# Altium schematic sheet Parent_sheet.SchDoc
size 594 x 420 mm; SheetNumber: 1; SheetTotal: 32; Scale: -; DocumentType: Схема электрическая принципиальная; DocumentGOSTLIt1: ㅤ; DocumentGOSTLIt2: ㅤ; DocumentGOSTLIt3: ㅤ; DocumentGOSTNote: Элементы, отмеченные *, используются при трассировке печатной платы, в состав модуля не включаются.; DocumentTypeShort: Э3; DocumentInvertoryNumber: ㅤ
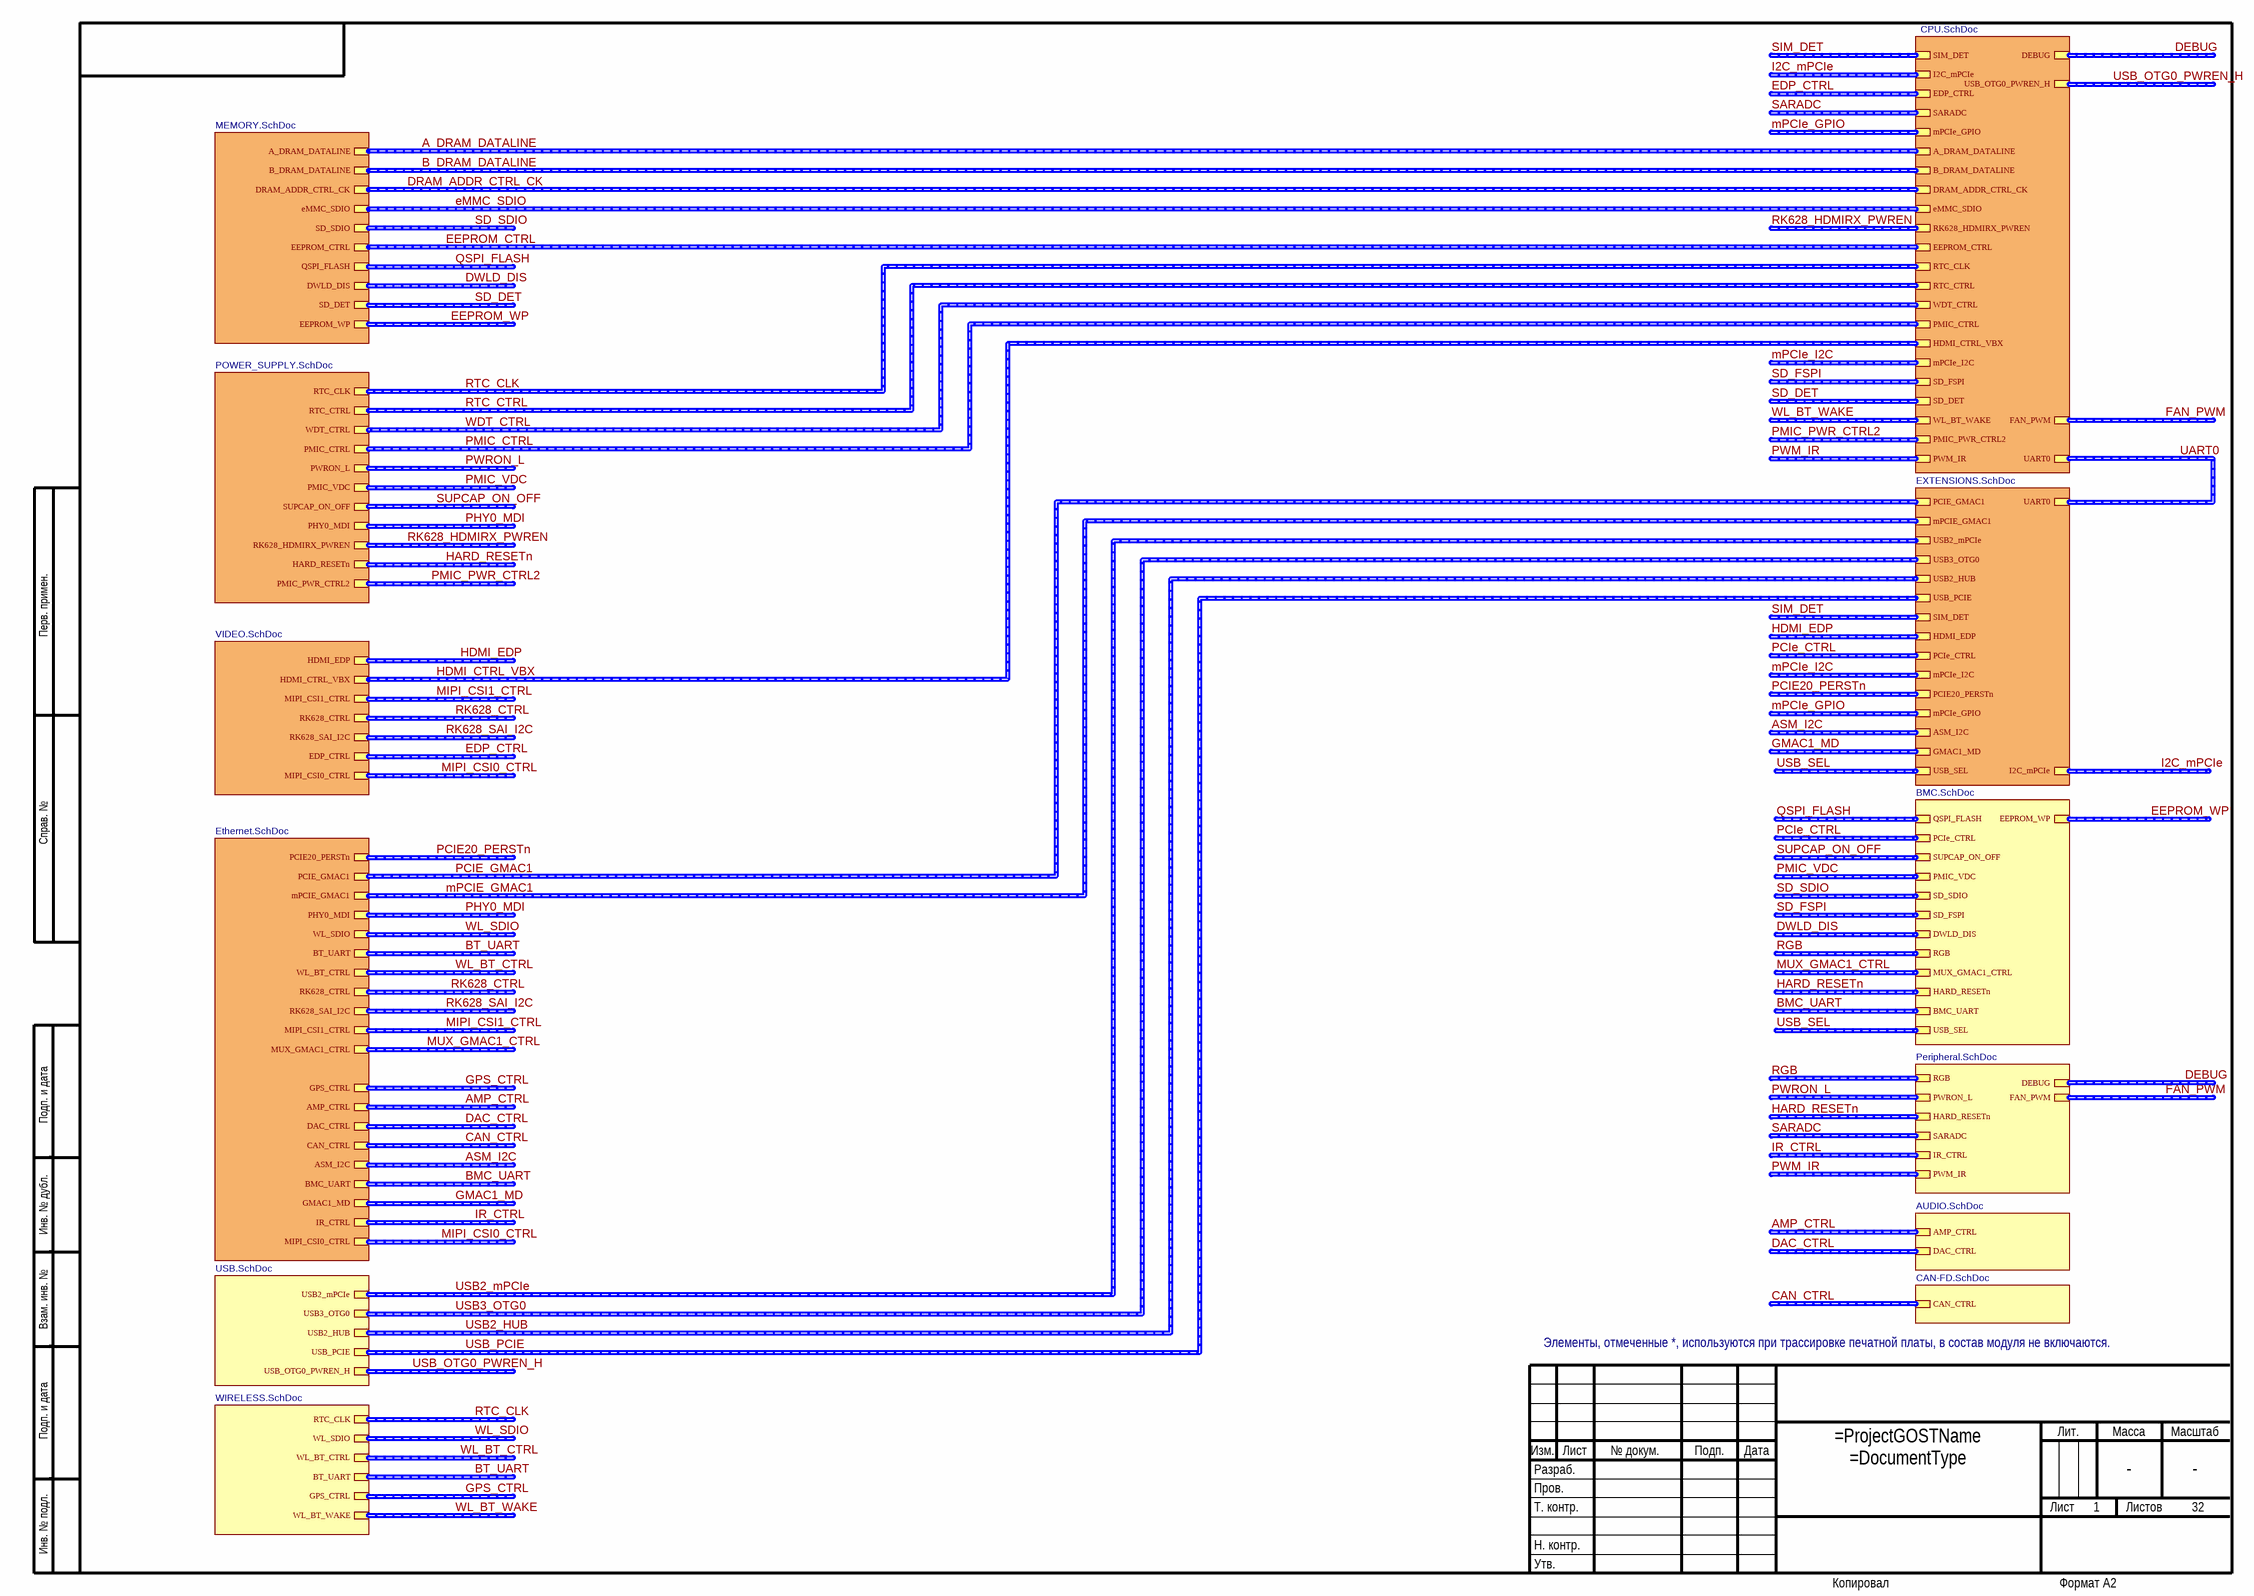
[diagram p0: Parent_sheet.SchDoc]

## Sub-sheets
AUDIO = AUDIO.SchDoc: AMP_CTRL (harness AMP_CTRL), DAC_CTRL (harness DAC_CTRL)
BMC = BMC.SchDoc: QSPI_FLASH (harness QSPI_FLASH), PCIe_CTRL (harness PCIe_CTRL), SUPCAP_ON_OFF (harness SUPCAP_ON_OFF), PMIC_VDC (harness PMIC_VDC), SD_SDIO (harness SD_SDIO), SD_FSPI (harness SD_FSPI), DWLD_DIS (harness DWLD_DIS), RGB (harness RGB), MUX_GMAC1_CTRL (harness MUX_GMAC1_CTRL), HARD_RESETn (harness HARD_RESETn), BMC_UART (harness BMC_UART), USB_SEL (harness USB_SEL), EEPROM_WP (harness EEPROM_WP)
CAN-FD = CAN-FD.SchDoc: CAN_CTRL (harness CAN_CTRL)
CPU = CPU.SchDoc: A_DRAM_DATALINE, B_DRAM_DATALINE, DRAM_ADDR_CTRL_CK, HDMI_CTRL_VBX, WDT_CTRL, RTC_CLK, RTC_CTRL, eMMC_SDIO, PMIC_CTRL, EEPROM_CTRL, SD_FSPI, SD_DET, WL_BT_WAKE, EDP_CTRL, SARADC, mPCIe_GPIO, RK628_HDMIRX_PWREN, SIM_DET, mPCIe_I2C, PMIC_PWR_CTRL2, PWM_IR, I2C_mPCIe, DEBUG, UART0, FAN_PWM, USB_OTG0_PWREN_H
Ethernet = Ethernet.SchDoc: PCIE_GMAC1, mPCIE_GMAC1, PHY0_MDI, WL_SDIO, BT_UART, WL_BT_CTRL, RK628_SAI_I2C, MIPI_CSI1_CTRL, MUX_GMAC1_CTRL, RK628_CTRL, GPS_CTRL, AMP_CTRL, DAC_CTRL, CAN_CTRL, ASM_I2C, BMC_UART, GMAC1_MD, PCIE20_PERSTn, IR_CTRL, MIPI_CSI0_CTRL
EXTENSIONS = EXTENSIONS.SchDoc: mPCIe_GPIO, SIM_DET, mPCIe_I2C, PCIE_GMAC1, mPCIE_GMAC1, USB3_OTG0, USB2_HUB, USB_PCIE, PCIe_CTRL, USB2_mPCIe, HDMI_EDP, ASM_I2C, GMAC1_MD, PCIE20_PERSTn, USB_SEL, I2C_mPCIe, UART0
MEMORY = MEMORY.SchDoc: A_DRAM_DATALINE, B_DRAM_DATALINE, DRAM_ADDR_CTRL_CK, eMMC_SDIO, SD_SDIO, EEPROM_CTRL, DWLD_DIS, SD_DET, QSPI_FLASH, EEPROM_WP
Peripheral = Peripheral.SchDoc: RGB (harness RGB), PWRON_L (harness PWRON_L), SARADC (harness SARADC), HARD_RESETn (harness HARD_RESETn), IR_CTRL (harness IR_CTRL), PWM_IR (harness PWM0_IR), DEBUG (harness DEBUG), FAN_PWM (harness FAN_PWM)
POWER_SUPPLY = POWER_SUPPLY.SchDoc: SUPCAP_ON_OFF, RTC_CLK, RTC_CTRL, WDT_CTRL, PHY0_MDI, PMIC_CTRL, PWRON_L, PMIC_VDC, HARD_RESETn, PMIC_PWR_CTRL2, RK628_HDMIRX_PWREN
USB = USB.SchDoc: USB2_mPCIe (harness USB2_mPCIe), USB3_OTG0 (harness USB3_OTG0), USB2_HUB (harness USB2_HUB), USB_PCIE (harness USB_PCIE), USB_OTG0_PWREN_H (harness USB_OTG0_PWREN_H)
VIDEO = VIDEO.SchDoc: HDMI_CTRL_VBX, MIPI_CSI1_CTRL, HDMI_EDP, RK628_SAI_I2C, EDP_CTRL, RK628_CTRL, MIPI_CSI0_CTRL
WIRELESS = WIRELESS.SchDoc: WL_SDIO (harness WL_SDIO), WL_BT_CTRL (harness WL_BT_CTRL), RTC_CLK (harness RTC_CLK), BT_UART (harness BT_UART), GPS_CTRL (harness GPS_CTRL), WL_BT_WAKE (harness WL_BT_WAKE)

## Buses and harness runs
harness A_DRAM_DATALINE = sheet CPU/A_DRAM_DATALINE = sheet MEMORY/A_DRAM_DATALINE
harness AMP_CTRL = sheet AUDIO/AMP_CTRL
harness AMP_CTRL = sheet Ethernet/AMP_CTRL
harness ASM_I2C = sheet Ethernet/ASM_I2C
harness ASM_I2C = sheet EXTENSIONS/ASM_I2C
harness B_DRAM_DATALINE = sheet CPU/B_DRAM_DATALINE = sheet MEMORY/B_DRAM_DATALINE
harness BMC_UART = sheet BMC/BMC_UART
harness BMC_UART = sheet Ethernet/BMC_UART
harness BT_UART = sheet Ethernet/BT_UART
harness BT_UART = sheet WIRELESS/BT_UART
harness CAN_CTRL = sheet CAN-FD/CAN_CTRL
harness CAN_CTRL = sheet Ethernet/CAN_CTRL
harness DAC_CTRL = sheet AUDIO/DAC_CTRL
harness DAC_CTRL = sheet Ethernet/DAC_CTRL
harness DEBUG = sheet CPU/DEBUG
harness DEBUG = sheet Peripheral/DEBUG
harness DRAM_ADDR_CTRL_CK = sheet CPU/DRAM_ADDR_CTRL_CK = sheet MEMORY/DRAM_ADDR_CTRL_CK
harness DWLD_DIS = sheet BMC/DWLD_DIS
harness DWLD_DIS = sheet MEMORY/DWLD_DIS
harness EDP_CTRL = sheet CPU/EDP_CTRL
harness EDP_CTRL = sheet VIDEO/EDP_CTRL
harness EEPROM_CTRL = sheet CPU/EEPROM_CTRL = sheet MEMORY/EEPROM_CTRL
harness EEPROM_WP = sheet BMC/EEPROM_WP
harness EEPROM_WP = sheet MEMORY/EEPROM_WP
harness eMMC_SDIO = sheet CPU/eMMC_SDIO = sheet MEMORY/eMMC_SDIO
harness FAN_PWM = sheet CPU/FAN_PWM
harness FAN_PWM = sheet Peripheral/FAN_PWM
harness GMAC1_MD = sheet Ethernet/GMAC1_MD
harness GMAC1_MD = sheet EXTENSIONS/GMAC1_MD
harness GPS_CTRL = sheet Ethernet/GPS_CTRL
harness GPS_CTRL = sheet WIRELESS/GPS_CTRL
harness HARD_RESETn = sheet BMC/HARD_RESETn
harness HARD_RESETn = sheet Peripheral/HARD_RESETn
harness HARD_RESETn = sheet POWER_SUPPLY/HARD_RESETn
harness HDMI_CTRL_VBX = sheet CPU/HDMI_CTRL_VBX = sheet VIDEO/HDMI_CTRL_VBX
harness HDMI_EDP = sheet EXTENSIONS/HDMI_EDP
harness HDMI_EDP = sheet VIDEO/HDMI_EDP
harness I2C_mPCIe = sheet CPU/I2C_mPCIe
harness I2C_mPCIe = sheet EXTENSIONS/I2C_mPCIe
harness IR_CTRL = sheet Ethernet/IR_CTRL
harness IR_CTRL = sheet Peripheral/IR_CTRL
harness MIPI_CSI0_CTRL = sheet Ethernet/MIPI_CSI0_CTRL
harness MIPI_CSI0_CTRL = sheet VIDEO/MIPI_CSI0_CTRL
harness MIPI_CSI1_CTRL = sheet Ethernet/MIPI_CSI1_CTRL
harness MIPI_CSI1_CTRL = sheet VIDEO/MIPI_CSI1_CTRL
harness mPCIE_GMAC1 = sheet Ethernet/mPCIE_GMAC1 = sheet EXTENSIONS/mPCIE_GMAC1
harness mPCIe_GPIO = sheet CPU/mPCIe_GPIO
harness mPCIe_GPIO = sheet EXTENSIONS/mPCIe_GPIO
harness mPCIe_I2C = sheet CPU/mPCIe_I2C
harness mPCIe_I2C = sheet EXTENSIONS/mPCIe_I2C
harness MUX_GMAC1_CTRL = sheet BMC/MUX_GMAC1_CTRL
harness MUX_GMAC1_CTRL = sheet Ethernet/MUX_GMAC1_CTRL
harness PCIE20_PERSTn = sheet Ethernet/PCIE20_PERSTn
harness PCIE20_PERSTn = sheet EXTENSIONS/PCIE20_PERSTn
harness PCIe_CTRL = sheet BMC/PCIe_CTRL
harness PCIe_CTRL = sheet EXTENSIONS/PCIe_CTRL
harness PCIE_GMAC1 = sheet Ethernet/PCIE_GMAC1 = sheet EXTENSIONS/PCIE_GMAC1
harness PHY0_MDI = sheet Ethernet/PHY0_MDI
harness PHY0_MDI = sheet POWER_SUPPLY/PHY0_MDI
harness PMIC_CTRL = sheet CPU/PMIC_CTRL = sheet POWER_SUPPLY/PMIC_CTRL
harness PMIC_PWR_CTRL2 = sheet CPU/PMIC_PWR_CTRL2
harness PMIC_PWR_CTRL2 = sheet POWER_SUPPLY/PMIC_PWR_CTRL2
harness PMIC_VDC = sheet BMC/PMIC_VDC
harness PMIC_VDC = sheet POWER_SUPPLY/PMIC_VDC
harness PWM_IR = sheet CPU/PWM_IR
harness PWM_IR = sheet Peripheral/PWM_IR
harness PWRON_L = sheet Peripheral/PWRON_L
harness PWRON_L = sheet POWER_SUPPLY/PWRON_L
harness QSPI_FLASH = sheet BMC/QSPI_FLASH
harness QSPI_FLASH = sheet MEMORY/QSPI_FLASH
harness RGB = sheet BMC/RGB
harness RGB = sheet Peripheral/RGB
harness RK628_CTRL = sheet Ethernet/RK628_CTRL
harness RK628_CTRL = sheet VIDEO/RK628_CTRL
harness RK628_HDMIRX_PWREN = sheet CPU/RK628_HDMIRX_PWREN
harness RK628_HDMIRX_PWREN = sheet POWER_SUPPLY/RK628_HDMIRX_PWREN
harness RK628_SAI_I2C = sheet Ethernet/RK628_SAI_I2C
harness RK628_SAI_I2C = sheet VIDEO/RK628_SAI_I2C
harness RTC_CLK = sheet CPU/RTC_CLK = sheet POWER_SUPPLY/RTC_CLK
harness RTC_CLK = sheet WIRELESS/RTC_CLK
harness RTC_CTRL = sheet CPU/RTC_CTRL = sheet POWER_SUPPLY/RTC_CTRL
harness SARADC = sheet CPU/SARADC
harness SARADC = sheet Peripheral/SARADC
harness SD_DET = sheet CPU/SD_DET
harness SD_DET = sheet MEMORY/SD_DET
harness SD_FSPI = sheet BMC/SD_FSPI
harness SD_FSPI = sheet CPU/SD_FSPI
harness SD_SDIO = sheet BMC/SD_SDIO
harness SD_SDIO = sheet MEMORY/SD_SDIO
harness SIM_DET = sheet CPU/SIM_DET
harness SIM_DET = sheet EXTENSIONS/SIM_DET
harness SUPCAP_ON_OFF = sheet BMC/SUPCAP_ON_OFF
harness SUPCAP_ON_OFF = sheet POWER_SUPPLY/SUPCAP_ON_OFF
harness UART0 = sheet CPU/UART0 = sheet EXTENSIONS/UART0
harness USB2_HUB = sheet EXTENSIONS/USB2_HUB = sheet USB/USB2_HUB
harness USB2_mPCIe = sheet EXTENSIONS/USB2_mPCIe = sheet USB/USB2_mPCIe
harness USB3_OTG0 = sheet EXTENSIONS/USB3_OTG0 = sheet USB/USB3_OTG0
harness USB_OTG0_PWREN_H = sheet CPU/USB_OTG0_PWREN_H
harness USB_OTG0_PWREN_H = sheet USB/USB_OTG0_PWREN_H
harness USB_PCIE = sheet EXTENSIONS/USB_PCIE = sheet USB/USB_PCIE
harness USB_SEL = sheet BMC/USB_SEL
harness USB_SEL = sheet EXTENSIONS/USB_SEL
harness WDT_CTRL = sheet CPU/WDT_CTRL = sheet POWER_SUPPLY/WDT_CTRL
harness WL_BT_CTRL = sheet Ethernet/WL_BT_CTRL
harness WL_BT_CTRL = sheet WIRELESS/WL_BT_CTRL
harness WL_BT_WAKE = sheet CPU/WL_BT_WAKE
harness WL_BT_WAKE = sheet WIRELESS/WL_BT_WAKE
harness WL_SDIO = sheet Ethernet/WL_SDIO
harness WL_SDIO = sheet WIRELESS/WL_SDIO

## Notes on the sheet
- Перв. примен.
- Справ. №
- Подп. и дата
- Инв. № дубл.
- Взам. инв. №
- Разраб.
- Изм.
- Лист
- № докум.
- Подп.
- Дата
- Лит.
- Масса
- Масштаб
- Пров.
- Т. контр.
- -
- Листов
- Инв. № подл.
- Утв.
- Н. контр.
- Копировал
- Формат А2